# EAGLE design 4G LTE Hat For Raspberry Pi V1.0 (EAGLE 6.1)
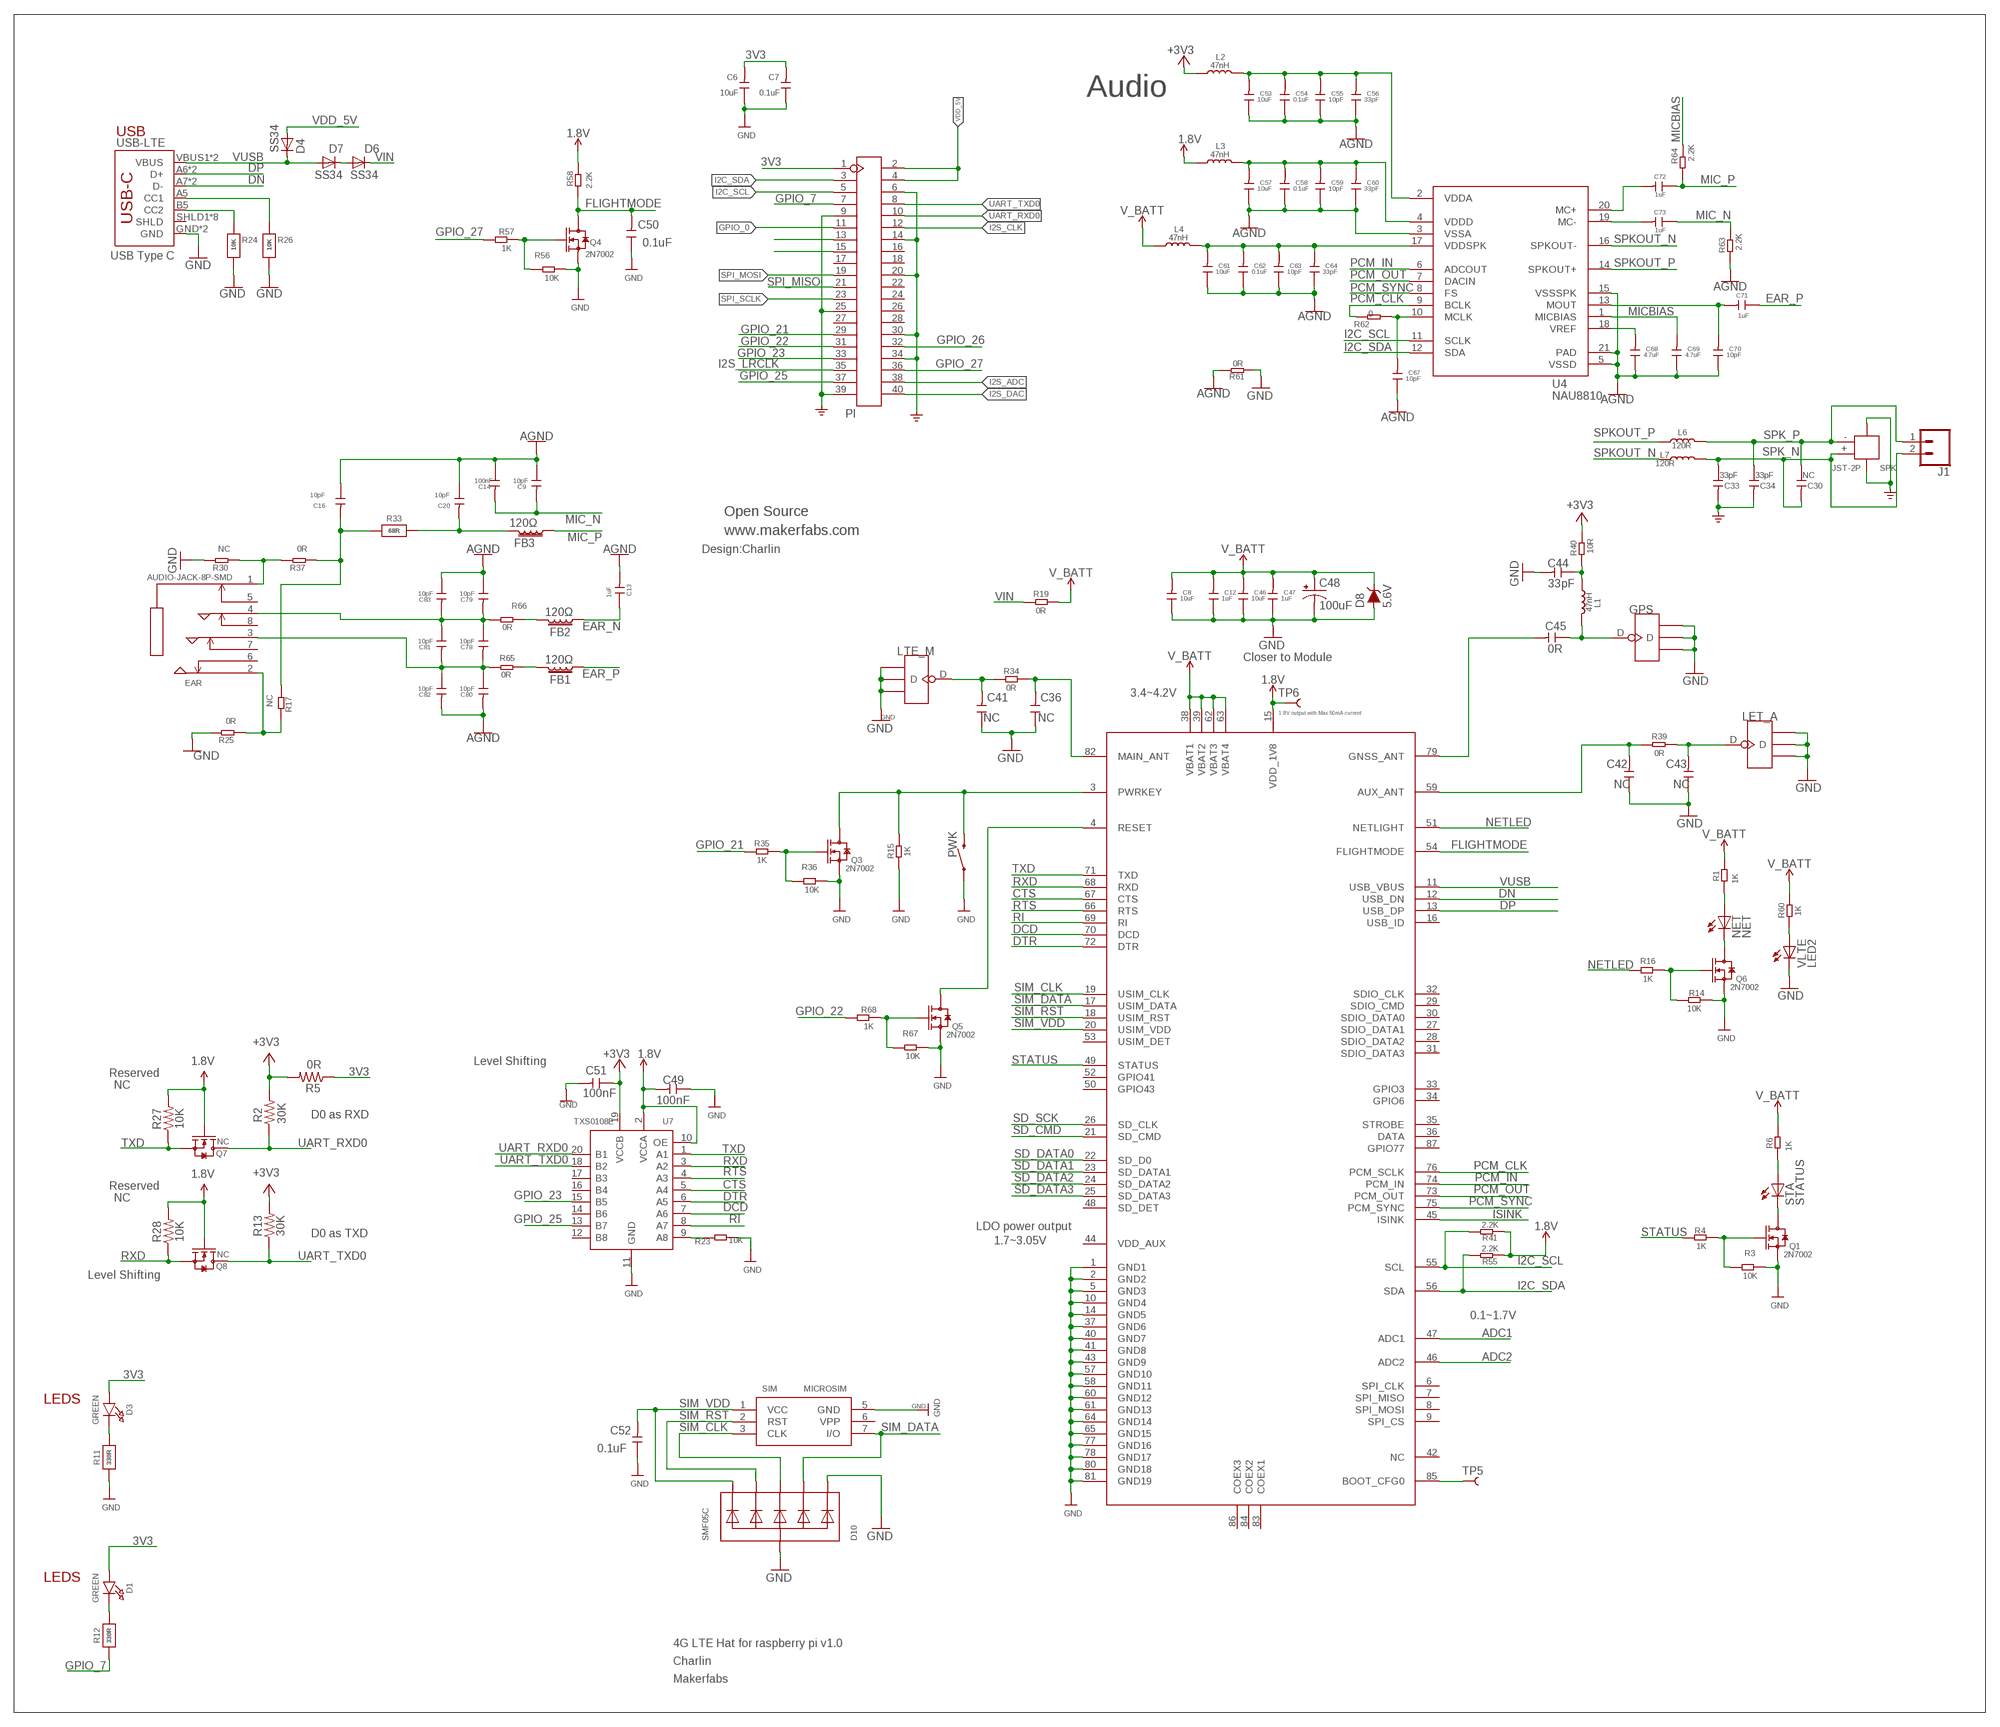
[diagram p0: schematic, sheet 1]

## Parts
C6  10uF  DISCRETE_C-0603  [DISCRETE_C0603]
C7  0.1uF  DISCRETE_C-0603  [DISCRETE_C0603]
C8  10uF  C-0603  [C0603]
C9  10pF  C-0603  [C0603]
C12  1uF  C-0603  [C0603]
C13  1uF  C-0603  [C0603]
C14  100nF  C-0603  [C0603]
C16  10pF  C-0603  [C0603]
C20  10pF  C-0603  [C0603]
C30  NC  CAP-0603  [C0603]
C33  33pF  CAP-0603  [C0603]
C34  33pF  CAP-0603  [C0603]
C36  NC  C-0603  [C0603]
C41  NC  C-0603  [C0603]
C42  NC  C-0603  [C0603]
C43  NC  C-0603  [C0603]
C44  33pF  C-0603  [C0603]
C45  0R  C-0603  [C0603]
C46  10uF  C-0603  [C0603]
C47  1uF  C-0603  [C0603]
C48  100uF  68UF-POLAR-EIA3528-10V-10%(TANT)  [EIA3528]
C49  100nF  C-0603  [C0603]
C50  0.1uF  C-0603  [C0603]
C51  100nF  C-0603  [C0603]
C52  0.1uF  C-0603  [C0603]
C53  10uF  C-0603  [C0603]
C54  0.1uF  C-0603  [C0603]
C55  10pF  C-0603  [C0603]
C56  33pF  C-0603  [C0603]
C57  10uF  C-0603  [C0603]
C58  0.1uF  C-0603  [C0603]
C59  10pF  C-0603  [C0603]
C60  33pF  C-0603  [C0603]
C61  10uF  C-0603  [C0603]
C62  0.1uF  C-0603  [C0603]
C63  10pF  C-0603  [C0603]
C64  33pF  C-0603  [C0603]
C67  10pF  C-0603  [C0603]
C68  4.7uF  C-0603  [C0603]
C69  4.7uF  C-0603  [C0603]
C70  10pF  C-0603  [C0603]
C71  1uF  C-0603  [C0603]
C72  1uF  C-0603  [C0603]
C73  1uF  C-0603  [C0603]
C78  10pF  C-0603  [C0603]
C79  10pF  C-0603  [C0603]
C80  10pF  C-0603  [C0603]
C81  10pF  C-0603  [C0603]
C82  10pF  C-0603  [C0603]
C83  10pF  C-0603  [C0603]
D1  GREEN  LED0805_NOOUTLINE  [CHIPLED_0805_NOOUTLINE]
D3  GREEN  LED0805_NOOUTLINE  [CHIPLED_0805_NOOUTLINE]
D4  SS34  DIODE-DO-214AC  [DO-214AC]
D6  SS34  DIODE-DO-214AC  [DO-214AC]
D7  SS34  DIODE-DO-214AC  [DO-214AC]
D8  5.6V  DIODE-ZENER-MMSZ5232BS  [SOD-323]
D10  SMF05C  TVSARRAY_5LANE  [SOT363]
EAR  AUDIO-JACK-8P-SMD  AUDIO-JACK-8P-SMD'PJ-393'  [AUDIO8P-SMD-3.5-14.5X6.1X4.0MM]
FB1  120Ω  FERRITE_BEAD-0603  [0603]
FB2  120Ω  FERRITE_BEAD-0603  [0603]
FB3  120Ω  FERRITE_BEAD-0603  [0603]
GPS  ANTENNA-U-FL  [4P-U-FL]
J1  CONN_02LOCK  [1X02_LOCK]
L1  47nH  L'0603'  [L0603]
L2  47nH  L'0603'  [L0603]
L3  47nH  L'0603'  [L0603]
L4  47nH  L'0603'  [L0603]
L6  120R  INDUCTOR/FERRITE-BEAD'0603'  [L0603]
L7  120R  INDUCTOR/FERRITE-BEAD'0603'  [L0603]
LET_A  ANTENNA-U-FL  [4P-U-FL]
LTE_M  ANTENNA-U-FL  [4P-U-FL]
NET  NET  LEDCHIP-LED0805  [CHIP-LED0805]
PI  HEADER-2X20P1  [DIP-2X20-2.54MM]
PWK  MOMENTARY-SWITCH-SPST-SMD-6.0X3.5MM  [TACTILE_SWITCH_SMD_6.0X3.5MM]
Q1  2N7002  MOSFET-N'SOT23'  [SOT23]
Q3  2N7002  MOSFET-N'SOT23'  [SOT23]
Q4  2N7002  MOSFET-N'SOT23'  [SOT23]
Q5  2N7002  MOSFET-N'SOT23'  [SOT23]
Q6  2N7002  MOSFET-N'SOT23'  [SOT23]
Q7  NC  MOSFET-N'SOT23'  [SOT23]
Q8  NC  MOSFET-N'SOT23'  [SOT23]
R1  1K  R-0603  [R0603]
R2  30K  300KOHM-0603-1/10W-1%  [0603]
R3  10K  R-0603  [R0603]
R4  1K  R-0603  [R0603]
R5  0R  300KOHM-0603-1/10W-1%  [0603]
R6  1K  R-0603  [R0603]
R11  330R  RESISTOR_0603_NOOUT  [0603-NO]
R12  330R  RESISTOR_0603_NOOUT  [0603-NO]
R13  30K  300KOHM-0603-1/10W-1%  [0603]
R14  10K  R-0603  [R0603]
R15  1K  R-0603  [R0603]
R16  1K  R-0603  [R0603]
R17  NC  R-0603  [R0603]
R19  0R  R-0603  [R0603]
R23  10K  R-0603  [R0603]
R24  10K  RESISTOR_0603_NOOUT  [0603-NO]
R25  0R  R-0603  [R0603]
R26  10K  RESISTOR_0603_NOOUT  [0603-NO]
R27  10K  300KOHM-0603-1/10W-1%  [0603]
R28  10K  300KOHM-0603-1/10W-1%  [0603]
R30  NC  R-0603  [R0603]
R33  68R  RESISTOR_0603_NOOUT  [0603-NO]
R34  0R  R-0603  [R0603]
R35  1K  R-0603  [R0603]
R36  10K  R-0603  [R0603]
R37  0R  R-0603  [R0603]
R39  0R  R-0603  [R0603]
R40  10R  R-0603  [R0603]
R41  2.2K  R-0603  [R0603]
R55  2.2K  R-0603  [R0603]
R56  10K  R-0603  [R0603]
R57  1K  R-0603  [R0603]
R58  2.2K  R-0603  [R0603]
R60  1K  R-0603  [R0603]
R61  0R  R-0603  [R0603]
R62  0  R-0603  [R0603]
R63  2.2K  R-0603  [R0603]
R64  2.2K  R-0603  [R0603]
R65  0R  R-0603  [R0603]
R66  0R  R-0603  [R0603]
R67  10K  R-0603  [R0603]
R68  1K  R-0603  [R0603]
SIM  MICROSIM  [MICROSIM]
SPK  JST-2P  JST-2P-SMD'2.0'  [HW2-SMD-2.0-90D]
STA  STATUS  LEDCHIP-LED0805  [CHIP-LED0805]
TP5  TEST-POINT3  [PAD.03X.03]
TP6  TEST-POINT3  [PAD.03X.03]
U4  NAU8810  [QFN21-50P-400L400W]
U6  SIM7600  [SMD87-100P-3000L300W]
U7  TXS0108E  LOGIC-TXS0108EPWR  [TSSOP20-0.65-6.5X4.4MM]
USB-LTE  USB_C5  [USB-C-16P-5]
VLTE  LED2  LEDCHIP-LED0805  [CHIP-LED0805]

## Nets
1.8V: C49.2 L3.1 Q7.1(G) Q8.1(G) R27.2 R28.2 R41.1 R55.1 R58.2 TP6.P$1 U6.15(VDD_1V8) U7.2(VCCA) U7.10(OE)
3V3: C6.2 C7.2 D1.A D3.A L2.1 PI.1 R5.1 ; supply symbol labelled +3V3
+3V3: C51.1 R2.2 R5.2 R13.2 R40.2 U7.19(VCCB)
ADC1: U6.47(ADC1)
ADC2: U6.46(ADC2)
AGND: C9.1 C13.2 C14.1 C16.1 C20.1 C53.1 C54.1 C55.1 C56.1 C57.1 C58.1 C59.1 C60.1 C61.1 C62.1 C63.1 C64.1 C67.1 C68.1 C69.1 C70.1 C79.1 C80.2 C82.2 C83.1 R61.2 R63.1 U4.3(VSSA) U4.5(VSSD) U4.15(VSSSPK) U4.21(PAD)
CTS: U6.67(CTS) U7.5(A4)
DCD: U6.70(DCD) U7.7(A6)
DN: U6.12(USB_DN) USB-LTE.A7(D-) USB-LTE.B7(D-)
DP: U6.13(USB_DP) USB-LTE.A6(D+) USB-LTE.B6(D+)
DTR: U6.72(DTR) U7.6(A5)
EAR_N: C13.1 FB2.1
EAR_P: C71.1 FB1.1
FLIGHTMODE: C50.2 Q4.3(D) R58.1 U6.54(FLIGHTMODE)
GND: C6.1 C7.1 C8.1 C12.1 C33.2 C34.2 C36.1 C41.1 C42.1 C43.1 C44.2 C46.1 C47.1 C48.C(-) C49.1 C50.1 C51.2 C52.1 D8.A D10.1(C1) D10.2(A) GPS.GND1 GPS.GND2 GPS.GND3 LET_A.GND1 LET_A.GND2 LET_A.GND3 LTE_M.GND1 LTE_M.GND2 LTE_M.GND3 PI.6 PI.9 PI.14 PI.20 PI.25 PI.30 PI.34 PI.39 PWK.1 Q1.2(S) Q3.2(S) Q4.2(S) Q5.2(S) Q6.2(S) R3.1 R11.1 R14.1 R15.1 R23.1 R24.2 R25.2 R26.2 R30.2 R36.1 R56.1 R61.1 R67.1 SIM.5(GND) SPK.3 SPK.4 U6.1(GND1) U6.2(GND2) U6.5(GND3) U6.10(GND4) U6.14(GND5) U6.37(GND6) U6.40(GND7) U6.41(GND8) U6.43(GND9) U6.57(GND10) U6.58(GND11) U6.60(GND12) U6.61(GND13) U6.64(GND14) U6.65(GND15) U6.77(GND16) U6.78(GND17) U6.80(GND18) U6.81(GND19) U7.11(GND) USB-LTE.GND USB-LTE.GND2(GND) VLTE.C ; supply symbol labelled GND_POWER
GPIO_0: PI.11
GPIO_2: PI.13
GPIO_3: PI.15
GPIO_7: PI.7 R12.1
GPIO_21: PI.29 R35.2
GPIO_22: PI.31 R68.2
GPIO_23: PI.33 U7.15(B5)
GPIO_25: PI.37 U7.13(B7)
GPIO_26: PI.32
GPIO_27: PI.36 R57.2
I2C_SCL: PI.5 R41.2 U4.11(SCLK) U6.55(SCL)
I2C_SDA: PI.3 R55.2 U4.12(SDA) U6.56(SDA)
I2S_ADC: PI.38
I2S_CLK: PI.12
I2S_DAC: PI.40
I2S_LRCLK: PI.35
ISINK: U6.45(ISINK)
MIC_N: C9.2 C14.2 C73.1 R63.2
MIC_P: C72.1 FB3.1 R64.1
MICBIAS: C69.2 R64.2 U4.1(MICBIAS)
N$2: Q1.1(G) R3.2 R4.1
N$3: D1.C R12.2
N$4: R6.1 STA.A
N$5: D3.C R11.2
N$6: Q1.3(D) STA.C
N$7: Q6.1(G) R14.2 R16.1
N$8: NET.A R1.1
N$9: NET.C Q6.3(D)
N$10: TP5.P$1 U6.85(BOOT_CFG0)
N$11: D6.A D7.C
N$14: C16.2 R17.1 R33.1 R37.1
N$15: C20.2 FB3.2 R33.2
N$16: EAR.2 R17.2 R25.1
N$17: R26.1 USB-LTE.A5(CC1)
N$19: R24.1 USB-LTE.B5(CC2)
N$20: EAR.1 R30.1 R37.2
N$21: C78.1 C79.2 C81.1 C83.2 EAR.4 R66.1
N$24: R23.2 U7.9(A8)
N$40: C36.2 R34.1 U6.82(MAIN_ANT)
N$41: C41.2 LTE_M.D R34.2
N$42: PWK.2 Q3.3(D) R15.2 U6.3(PWRKEY)
N$43: Q3.1(G) R35.1 R36.2
N$46: R60.1 VLTE.A
N$48: C53.2 C54.2 C55.2 C56.2 L2.2 U4.2(VDDA)
N$49: C70.2 C71.2 U4.13(MOUT)
N$50: C61.2 C62.2 C63.2 C64.2 L4.2 U4.17(VDDSPK)
N$51: C68.2 U4.18(VREF)
N$52: C57.2 C58.2 C59.2 C60.2 L3.2 U4.4(VDDD)
N$54: C73.2 U4.19(MC-)
N$57: C67.2 R62.1 U4.10(MCLK)
N$58: C72.2 U4.20(MC+)
N$59: FB1.2 R65.2
N$63: FB2.2 R66.2
N$64: C78.2 C80.1 C81.2 C82.1 EAR.3 R65.1
N$69: Q5.3(D) U6.4(RESET)
N$70: Q5.1(G) R67.2 R68.1
N$72: C43.2 LET_A.D R39.2
N$73: C44.1 L1.1 R40.1
N$74: C42.2 R39.1 U6.59(AUX_ANT)
N$75: C45.2 U6.79(GNSS_ANT)
N$76: C45.1 GPS.D L1.2
N$94: Q4.1(G) R56.2 R57.1
NETLED: R16.2 U6.51(NETLIGHT)
PCM_CLK: R62.2 U4.9(BCLK) U6.76(PCM_SCLK)
PCM_IN: U4.6(ADCOUT) U6.74(PCM_IN)
PCM_OUT: U4.7(DACIN) U6.73(PCM_OUT)
PCM_SYNC: U4.8(FS) U6.75(PCM_SYNC)
RI: U6.69(RI) U7.8(A7)
RTS: U6.66(RTS) U7.4(A3)
RXD: Q8.2(S) R28.1 U6.68(RXD) U7.3(A2)
SD_CMD: U6.21(SD_CMD)
SD_DATA0: U6.22(SD_D0)
SD_DATA1: U6.23(SD_DATA1)
SD_DATA2: U6.24(SD_DATA2)
SD_DATA3: U6.25(SD_DATA3)
SD_SCK: U6.26(SD_CLK)
SIM_CLK: D10.4(C3) SIM.3(CLK) U6.19(USIM_CLK)
SIM_DATA: D10.3(C2) SIM.7(I/O) U6.17(USIM_DATA)
SIM_RST: D10.5(C4) SIM.2(RST) U6.18(USIM_RST)
SIM_VDD: C52.2 D10.6(C5) SIM.1(VCC) U6.20(USIM_VDD)
SPI_MISO: PI.21
SPI_MOSI: PI.19
SPI_SCLK: PI.23
SPK_N: C30.2 C33.1 J1.2 L7.2 SPK.+
SPK_P: C30.1 C34.1 J1.1 L6.2 SPK.-
SPKOUT_N: L7.1 U4.16(SPKOUT-)
SPKOUT_P: L6.1 U4.14(SPKOUT+)
STATUS: R4.2 U6.49(STATUS)
TXD: Q7.2(S) R27.1 U6.71(TXD) U7.1(A1)
UART_RXD0: PI.10 Q7.3(D) R2.1 U7.20(B1)
UART_TXD0: PI.8 Q8.3(D) R13.1 U7.18(B2)
V_BATT: C8.2 C12.2 C46.2 C47.2 C48.A(+) D8.C L4.1 R1.2 R6.2 R19.1 R60.2 U6.38(VBAT1) U6.39(VBAT2) U6.62(VBAT3) U6.63(VBAT4)
VDD_5V: D4.A PI.2 PI.4
VIN: D6.C R19.2
VUSB: D4.C D7.A U6.11(USB_VBUS) USB-LTE.VBUS1(VBUS) USB-LTE.VBUS2(VBUS)
Unconnected: EAR.5 EAR.6 EAR.7 EAR.8 PI.16 PI.17 PI.18 PI.22 PI.24 PI.26 PI.27 PI.28 SIM.6(VPP) U6.6(SPI_CLK) U6.7(SPI_MISO) U6.8(SPI_MOSI) U6.9(SPI_CS) U6.16(USB_ID) U6.27(SDIO_DATA1) U6.28(SDIO_DATA2) U6.29(SDIO_CMD) U6.30(SDIO_DATA0) U6.31(SDIO_DATA3) U6.32(SDIO_CLK) U6.33(GPIO3) U6.34(GPIO6) U6.35(STROBE) U6.36(DATA) U6.42(NC) U6.44(VDD_AUX) U6.48(SD_DET) U6.50(GPIO43) U6.52(GPIO41) U6.53(USIM_DET) U6.83(COEX1) U6.84(COEX2) U6.86(COEX3) U6.87(GPIO77) U7.12(B8) U7.14(B6) U7.16(B4) U7.17(B3) USB-LTE.SHLD1(SHLD) USB-LTE.SHLD2(SHLD) USB-LTE.SHLD3(SHLD) USB-LTE.SHLD4(SHLD) USB-LTE.SHLD5(SHLD) USB-LTE.SHLD6(SHLD) USB-LTE.SHLD7(SHLD) USB-LTE.SHLD8(SHLD)

## Notes on the sheet
- Audio
- USB
- USB Type C
- Open Source
- www.makerfabs.com
- Design:Charlin
- Closer to Module
- 3.4~4.2V
- 1.8V output with Max 50mA current
- Level Shifting
- Reserved
- NC
- D0 as RXD
- Reserved
- NC
- LDO power output
- D0 as TXD
- 1.7~3.05V
- Level Shifting
- 0.1~1.7V
- LEDS
- LEDS
- 4G LTE Hat for raspberry pi v1.0
- Charlin
- Makerfabs

## Library data of the parts
C6 C7 = A9G:DISCRETE_C*: Ceramic Capacitors
C8 C9 C12-C14 C16 C20 C36 C41-C47 C49-C64 C67-C73 C78-C83 = Discrete:C*: Ceramic Capacitors
C30 C33 C34 = Discrete-new:CAP: Ceramic Capacitors
C48 = SparkFun-Capacitors:68UF-POLAR: 68µF polarized capacitors A capacitor is a passive two-terminal electrical component used to store electrical energy temporarily in an electric field.; PROD_ID: CAP-10790; VALUE: 68uF
D1 D3 = microbuilder:LED: LED
D4 D6 D7 = diode:DIODE-: DIODE
D8 = SparkFun-DiscreteSemi:DIODE-ZENER: Zener Diode A Zener diode allows current to flow from its anode to its cathode like a normal semiconductor diode, but it also permits current to flow in the reverse direction when its "Zener voltage" is reached. - WIkipedia; PROD_ID: DIO-12442
D10 = microbuilder:TVSARRAY_5LANE: Voltage Transient Suppressor Array SOT363 SMF05C - 100W 5V: Digikey - SMF05CT1GOSCT-ND
EAR = Connector-new:AUDIO-JACK-8P-SMD: 320040009
FB1-FB3 = SparkFun-Coils:FERRITE_BEAD: Ferrite Bead (blocks, cores, rings, chokes, etc.) Inductor with layers of ferrite used to suppress high frequencies. Often used to isolate high frequency noise. SparkFun Products: IOIO-OTG - V2.2 <https://www.sparkfun.com/products/13613> SparkFun SAMD21 Mini Breakout <https://www.sparkfun.com/products/13664> SparkFun 6 Degrees of Freedom Breakout - LSM6DS3 <https://www.sparkfun.com/products/13339> SparkFun SAMD21 Dev Breakout <https://www.sparkfun.com/products/13672>; PROD_ID: NDUC-13805; VALUE: 30Ω/1.8A
GPS LET_A LTE_M = Connector:ANTENNA-U-FL
J1 = SparkFun-Connectors:CONN_02: Multi connection point. Often used as Generic Header-pin footprint for 0.1 inch spaced/style header connections On any of the 0.1 inch spaced packages, you can populate with these: Break Away Headers - Straight <https://www.sparkfun.com/products/116> (PRT-00116) Break Away Male Headers - Right Angle <https://www.sparkfun.com/products/553> (PRT-00553) Female Headers <https://www.sparkfun.com/products/115> (PRT-00115) Break Away Headers - Machine Pin <https://www.sparkfun.com/products/117> (PRT-00117) Break Away Female Headers - Swiss Machine Pin <https://www.sparkfun.com/products/743> (PRT-00743) For SCREWTERMINALS and SPRING TERMINALS visit here: Screw Terimnals on SparkFun.com <https://www.sparkfun.com/search/results?term=Screw+Terminals> (5mm/3.5mm/2.54mm spacing) This device is also useful as a general connection point to wire up your design to another part of your project. Our various solder wires solder well into these plated through hole pads. Hook-Up Wire - Assortment (Stranded, 22 AWG) <https://www.sparkfun.com/products/11375> (PRT-11375) Hook-Up Wire - Assortment (Solid Core, 22 AWG) <https://www.sparkfun.com/products/11367> (PRT-11367) View the entire wire category on our website here <https://www.sparkfun.com/categories/141> Special notes: Molex polarized connector foot print use with: PRT-08233 with associated crimp pins and housings. 2.54_SCREWTERM for use with PRT-10571. 3.5mm Screw Terminal footprints for PRT-08084 5mm Screw Terminal footprints for use with PRT-08432
L1-L4 = Discrete:L*
L6 L7 = Discrete-new:INDUCTOR/FERRITE-BEAD
NET STA VLTE = adafruit2:LED: LED
PI = self:HEADER-2X20P
PWK = SparkFun-Switches:MOMENTARY-SWITCH-SPST: Momentary Switch (Pushbutton) - SPST Normally-open (NO) SPST momentary switches (buttons, pushbuttons). Variants PTH-12MM - 12mm square, through-hole Momentary Pushbutton Switch - 12mm Square <https://www.sparkfun.com/products/9190> (COM-09190) PTH-6.0MM, PTH-6.0MM-KIT - 6.0mm square, through-hole Mini Pushbutton Switch <https://www.sparkfun.com/products/97> (COM-00097) KIT package intended for soldering kit's - only one side of pads' copper is exposed. PTH-RIGHT-ANGLE-KIT - Right-angle, through-hole Right Angle Tactile Button <https://www.sparkfun.com/products/10791> - Used on SparkFun BigTime Watch Kit <https://www.sparkfun.com/products/11734> SMD-12MM - 12mm square, surface-mount Tactile Button - SMD (12mm) <https://www.sparkfun.com/products/12993> (COM-12993) Used on SparkFun PicoBoard <https://www.sparkfun.com/products/11888> SMD-4.5MM - 4.5mm Square Trackball Switch Used on SparkFun Blackberry Trackballer Breakout <https://www.sparkfun.com/products/13169> SMD-4.6MMX2.8MM - 4.60mm x 2.80mm, surface mount Used on SparkFun SAMD21 Mini Breakout <https://www.sparkfun.com/products/13664> SMD-5.2MM, SMD-5.2-REDUNDANT - 5.2mm square, surface-mount Mini Pushbutton Switch - SMD <https://www.sparkfun.com/products/8720> (COM-08720) Used on Arduino Pro Mini <https://www.sparkfun.com/products/11114> REDUNDANT package connects both switch circuits together SMD-6.0X3.5MM - 6.0 x 3.5mm, surface mount Momentary Reset Switch SMD <https://www.sparkfun.com/products/8229> (COM-08229) SMD-6.2MM-TALL - 6.2mm square, surface mount Tactile Button - SMD (6mm) <https://www.sparkfun.com/products/12992> Used on SparkFun Digital Sandbox <https://www.sparkfun.com/products/12651> SMD-RIGHT-ANGLE - Right-angle, surface mount Used on SparkFun Block for Intel® Edison - Arduino <https://www.sparkfun.com/products/13036>; PROD_ID: SWCH-00815; SF_SKU: COM-08229
Q1 Q3-Q8 = Discrete:MOSFET-N: IRLL014: http://www.vishay.com/docs/91319/sihll014.pdf
R1 R3 R4 R6 R14-R17 R19 R23 R25 R30 R34-R37 R39-R41 R55-R58 R60-R68 = Discrete:R*
R2 R5 R13 R27 R28 = SparkFun-Resistors:300KOHM: 300kΩ resistor A resistor is a passive two-terminal electrical component that implements electrical resistance as a circuit element. Resistors act to reduce current flow, and, at the same time, act to lower voltage levels within circuits. - Wikipedia; PROD_ID: RES-10809; VALUE: 300k
R11 R12 R24 R26 R33 = microbuilder:RESISTOR: Resistors For new designs, use the packages preceded by an '_' character since they are more reliable: The following footprints should be used on most boards: _0402 - Standard footprint for regular board layouts _0603 - Standard footprint for regular board layouts _0805 - Standard footprint for regular board layouts _1206 - Standard footprint for regular board layouts For extremely tight-pitch boards where space is at a premium, the following 'micro-pitch' footprints can be used (smaller pads, no silkscreen outline, etc.): _0402MP - Micro-pitch footprint for very dense/compact boards _0603MP - Micro-pitch footprint for very dense/compact boards _0805MP - Micro-pitch footprint for very dense/compact boards _1206MP - Micro-pitch footprint for very dense/compact boards
SIM = Connector:MICROSIM
SPK = Connector-new:JST-2P-SMD: 2P-SMD-1.0-90D:320110054;2P-SMD-2.0-90D:320110026
TP5 TP6 = SparkFun-Connectors:TEST-POINT: SparkFun Test Points Bare copper test points for troubleshooting or In-Circuit-Testing. These are used by our Production team for verifying production board runs using pogo-pins on test beds. SparkFun Products: SparkFun LSM9DS1 Breakout <https://www.sparkfun.com/products/13284> SparkFun PSOC <https://www.sparkfun.com/products/13714> SparkFun Load Cell Amplifier <https://www.sparkfun.com/products/13879>
U4 = user01:NAU8810: NAU8810
U6 = user01:SIM7600
U7 = IC-new:LOGIC-TXS0108EPWR: 310050026
USB-LTE = USBC:USB_C: USB Type C 16Pin Connector Super Speed pins not available on the 16-pin purely SMD connector so this part is best for USB 2.0 implementations. D1 and D2 are tied together enabling D+/- no matter which way the cable is plugged into the connector. The two channel configuration pins (CC1/2) are exposed. These are normally connected to ground via 5.1k resistors but can be reconfigured for high current/high power applications.

## Net classes
2 3V3: width 0.305 mm
3 usbvcc: width 0.508 mm, drill 0.61 mm, clearance 0.254 mm

## Board
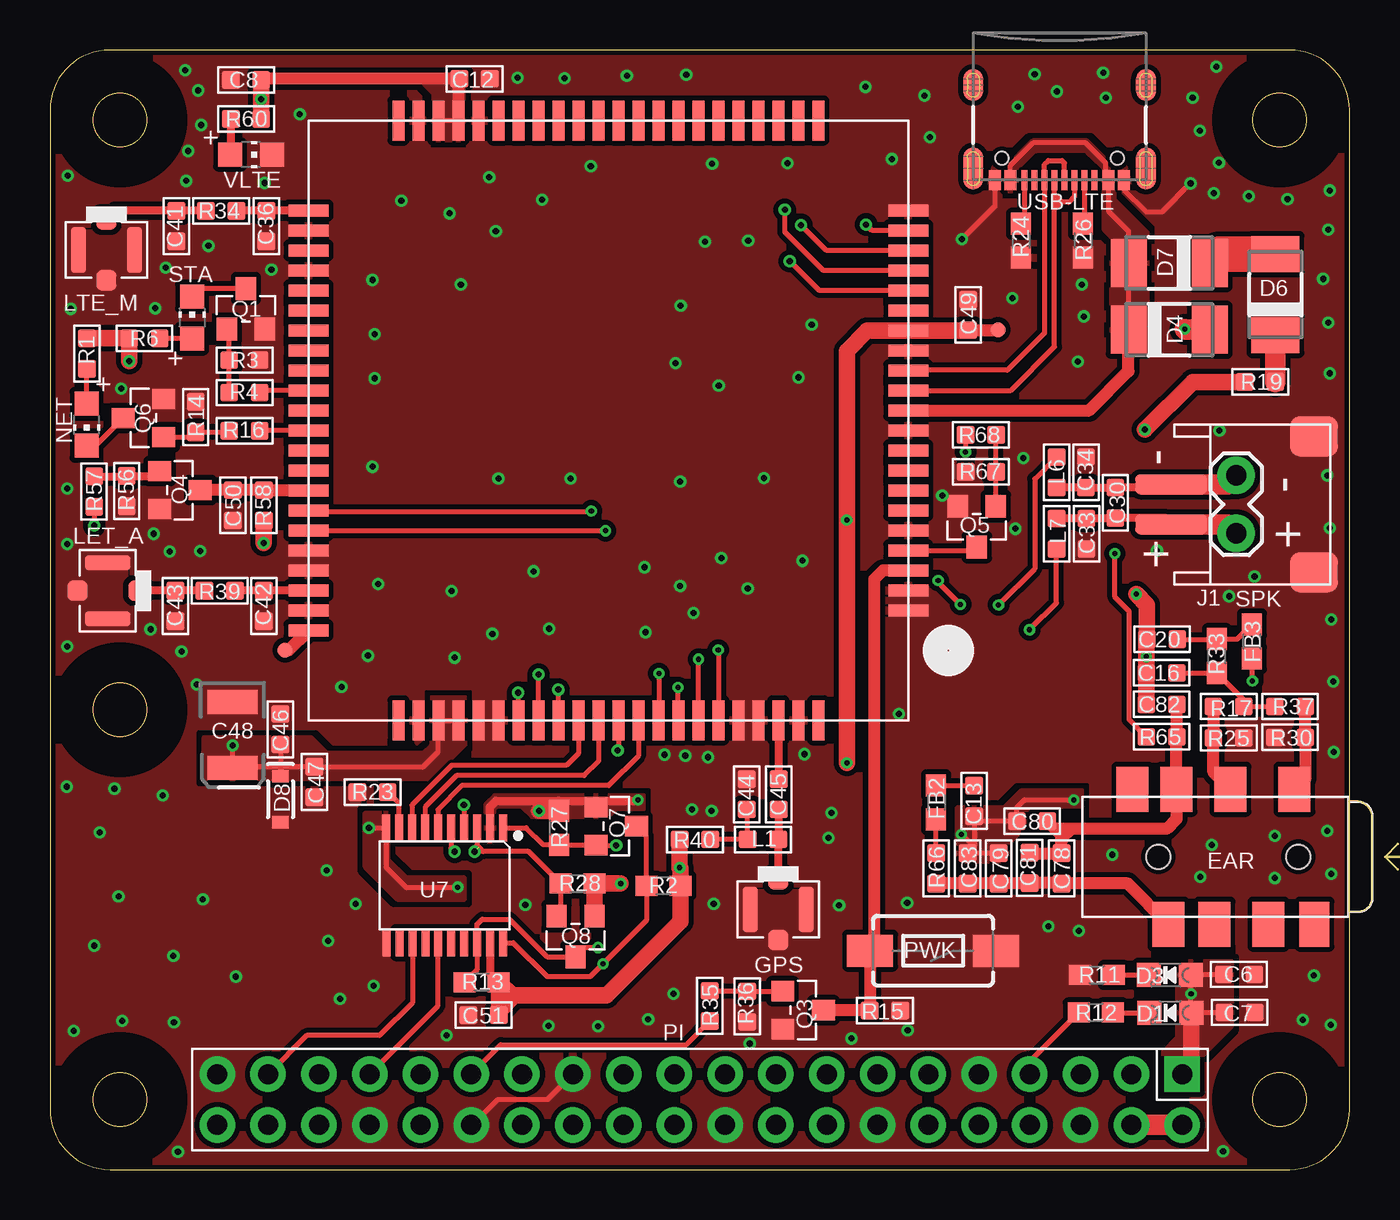
[diagram p1: board, top side]
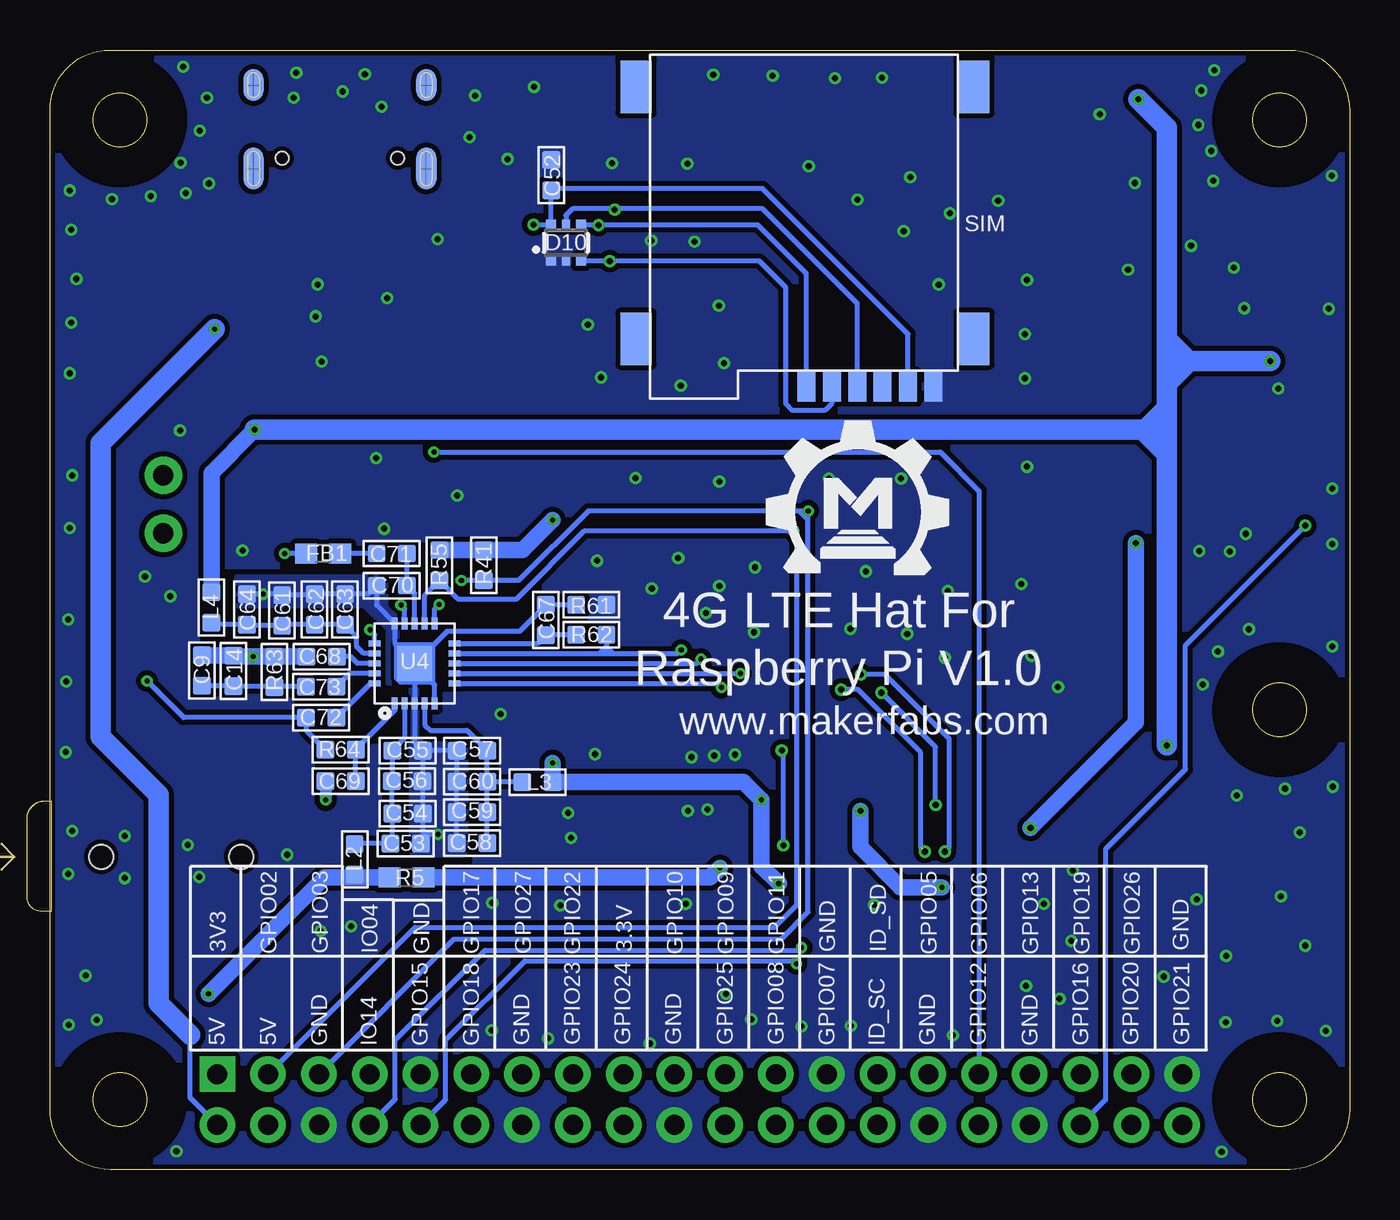
[diagram p2: board, bottom side, seen from below]

Size 65 x 56 mm. Coordinates in mm from the lower left corner, seen from the top.
Outline: 0,53 0,3 arc90 3,0 62,0 arc90 65,3 65,53 arc90 62,56 3,56 arc90 0,53
Outline: circle at 61.5,3.5 radius 1.35
Outline: circle at 61.5,52.5 radius 1.35
Outline: circle at 3.5,3.5 radius 1.35
Outline: circle at 3.5,52.5 radius 1.35
Outline: circle at 3.5,23 radius 1.35
Copper layers (1*16): Top 0.035mm / dielectric 1.5mm / Bottom 0.035mm
Design rules: minimum track width 6mil, minimum drill 10mil, track to track 6mil, track to pad 6mil, pad to pad 6mil, via to via 6mil, smd to smd 0mil, copper to edge 10mil, drill to drill 10mil, minimum pad ring 10mil, minimum via ring 6mil, stop-mask expansion 2mil, vias tented up to drill 100mil, thermal gap 0mil
tRestrict: area 0.5,0.5 to 6.5,6.5; area 58.5,0.5 to 64.5,6.5; area 58.5,49.5 to 64.5,55.5; area 0.5,49.5 to 6.5,55.5; area 0.5,20 to 6.5,26
bRestrict: area 58.5,49.5 to 64.5,55.5; area 0.5,49.5 to 6.5,55.5; area 58.5,0.5 to 64.5,6.5; area 0.5,0.5 to 6.5,6.5; area 0.5,20 to 6.5,26; area 0.5,20 to 6.5,26

### Footprints (pad centres in the part's own frame; a part is rotated, then mirrored left to right if it is on the bottom)
DISCRETE_C0603 = smd 0.889 x 0.889: 1 -0.762,0; 2 0.762,0
C0603 = smd 0.889 x 0.889: 1 -0.762,0; 2 0.762,0
C0603' = smd 0.889 x 0.889: 1 0,0.762; 2 0,-0.762
EIA3528 = smd 1.2 x 2.5: A 1.65,0; C -1.65,0
CHIPLED_0805_NOOUTLINE = smd 1.2 x 1.2: A 0,-1.05; C 0,1.05
DO-214AC = smd 1.8 x 2.4: A 2.025,0; C -2.025,0
SOD-323 = smd 0.63 x 0.83: A 1.15,0; C -1.15,0
SOT363 = smd 0.5 x 0.5: 1 -0.75,-0.9; 3 0.75,-0.9; 4 0.75,0.9; 6 -0.75,0.9 | smd 0.4 x 0.5: 2 0,-0.9; 5 0,0.9
AUDIO8P-SMD-3.5-14.5X6.1X4.0MM = smd 1.6 x 2.25: 1 3.9,-3.375; 2 7.1,-3.375; 3 9.8,-3.375; 4 10.2,3.375; 6 5.2,3.375; 7 7.9,3.375; 8 12,-3.375 | smd 1.5 x 2.25: 5 2.9,3.375 | hole 1.2: 3.7,0; 10.7,0
0603 = smd 1.1 x 1: 1 -0.85,0; 2 0.85,0
4P-U-FL = smd 1.016 x 1.016: D -1.524,0; GND3 1.524,0 | smd 2.286 x 0.762: GND1 0,1.397; GND2 0,-1.397
1X02_LOCK = drill 1.016 pad 1.88: 1 -0.178,0; 2 2.718,0
L0603 = smd 0.889 x 0.889: 1 -0.762,0; 2 0.762,0
CHIP-LED0805 = smd 1.2 x 1.2: A 0,-1.05; C 0,1.05
DIP-2X20-2.54MM = drill 1 pad 1.778 square: 1 24.13,1.27 | drill 1 pad 1.778: 2 24.13,-1.27; 3 21.59,1.27; 4 21.59,-1.27; 5 19.05,1.27; 6 19.05,-1.27; 7 16.51,1.27; 8 16.51,-1.27; 9 13.97,1.27; 10 13.97,-1.27; 11 11.43,1.27; 12 11.43,-1.27; 13 8.89,1.27; 14 8.89,-1.27; 15 6.35,1.27; 16 6.35,-1.27; 17 3.81,1.27; 18 3.81,-1.27; 19 1.27,1.27; 20 1.27,-1.27; 21 -1.27,1.27; 22 -1.27,-1.27; 23 -3.81,1.27; 24 -3.81,-1.27; 25 -6.35,1.27; 26 -6.35,-1.27; 27 -8.89,1.27; 28 -8.89,-1.27; 29 -11.43,1.27; 30 -11.43,-1.27; 31 -13.97,1.27; 32 -13.97,-1.27; 33 -16.51,1.27; 34 -16.51,-1.27; 35 -19.05,1.27; 36 -19.05,-1.27; 37 -21.59,1.27; 38 -21.59,-1.27; 39 -24.13,1.27; 40 -24.13,-1.27
TACTILE_SWITCH_SMD_6.0X3.5MM = smd 2.3 x 1.6: 1 -3.15,0; 2 3.15,0
SOT23 = smd 1.016 x 1.143: 1 -0.95,-1.016; 2 0.95,-1.016; 3 0,1.016
R0603 = smd 0.889 x 0.889: 1 -0.762,0; 2 0.762,0
0603-NO = smd 1.1 x 1: 1 -0.85,0; 2 0.85,0
MICROSIM = smd 1.5 x 0.9: 1 -0.8,2.5; 2 -0.8,5.04; 3 -0.8,7.58; 5 -0.8,1.23; 6 -0.8,3.77; 7 -0.8,6.31 | smd 2.61 x 1.56: P$1 1.6,-0.8; P$2 14.2,-0.8; P$3 14.2,16.1; P$4 1.6,16.1
HW2-SMD-2.0-90D = smd 2 x 2.4: 3 3.4,-2.181; 4 -3.4,-2.181 | smd 1 x 3.6: + -1,4.953; - 1,4.953
PAD.03X.03 = smd 0.762 x 0.762: P$1 0,0
QFN21-50P-400L400W = smd 0.6 x 0.3: 1 0,0; 2 0,-0.5; 3 0,-1; 4 0,-1.5; 5 0,-2; 11 4,-2; 12 4,-1.5; 13 4,-1; 14 4,-0.5; 15 4,0 | smd 0.3 x 0.6: 6 1,-3; 7 1.5,-3; 8 2,-3; 9 2.5,-3; 10 3,-3; 16 3,1; 17 2.5,1; 18 2,1; 19 1.5,1; 20 1,1 | smd 1.75 x 1.75: 21 2,-1
SMD87-100P-3000L300W = smd 2 x 0.6: 1 0,0; 2 0,-1; 3 0,-2; 4 0,-3; 5 0,-4; 6 0,-5; 7 0,-6; 8 0,-7; 9 0,-8; 10 0,-9; 11 0,-10; 12 0,-11; 13 0,-12; 14 0,-13; 15 0,-14; 16 0,-15; 17 0,-16; 18 0,-17; 19 0,-18; 20 0,-19; 41 30,-19; 42 30,-18; 43 30,-17; 44 30,-16; 45 30,-15; 46 30,-14; 47 30,-13; 48 30,-12; 49 30,-11; 50 30,-10; 51 30,-9; 52 30,-8; 53 30,-7; 54 30,-6; 55 30,-5; 56 30,-4; 57 30,-3; 58 30,-2; 59 30,-1; 60 30,0; 81 0,-20; 82 30,-20; 85 30,1 | smd 0.6 x 2: 21 5.5,-24.5; 22 6.5,-24.5; 23 7.5,-24.5; 24 8.5,-24.5; 25 9.5,-24.5; 26 10.5,-24.5; 27 11.5,-24.5; 28 12.5,-24.5; 29 13.5,-24.5; 30 14.5,-24.5; 31 15.5,-24.5; 32 16.5,-24.5; 33 17.5,-24.5; 34 18.5,-24.5; 35 19.5,-24.5; 36 20.5,-24.5; 37 21.5,-24.5; 38 22.5,-24.5; 39 23.5,-24.5; 40 24.5,-24.5; 61 24.5,5.5; 62 23.5,5.5; 63 22.5,5.5; 64 21.5,5.5; 65 20.5,5.5; 66 19.5,5.5; 67 18.5,5.5; 68 17.5,5.5; 69 16.5,5.5; 70 15.5,5.5; 71 14.5,5.5; 72 13.5,5.5; 73 12.5,5.5; 74 11.5,5.5; 75 10.5,5.5; 76 9.5,5.5; 77 8.5,5.5; 78 7.5,5.5; 79 6.5,5.5; 80 5.5,5.5; 83 25.5,-24.5; 84 4.5,-24.5; 86 4.5,5.5; 87 25.5,5.5
TSSOP20-0.65-6.5X4.4MM = smd 0.4 x 1.35: 1 -2.925,-2.875; 2 -2.275,-2.875; 3 -1.625,-2.875; 4 -0.975,-2.875; 5 -0.325,-2.875; 6 0.325,-2.875; 7 0.975,-2.875; 8 1.625,-2.875; 9 2.275,-2.875; 10 2.925,-2.875; 11 2.91,2.875; 12 2.26,2.875; 13 1.61,2.875; 14 0.96,2.875; 15 0.325,2.875; 16 -0.325,2.875; 17 -0.975,2.875; 18 -1.625,2.875; 19 -2.275,2.875; 20 -2.925,2.875
USB-C-16P-5 = smd 0.3 x 1: A5 -1.25,-0.34; A6 -0.25,-0.34; A7 0.25,-0.34; A8 1.25,-0.34; B5 1.75,-0.34; B6 0.75,-0.34; B7 -0.75,-0.34; B8 -1.75,-0.34 | smd 0.6 x 1: GND -3.225,-0.34; GND2 3.225,-0.34; VBUS1 -2.45,-0.34; VBUS2 2.45,-0.34 | smd 1 x 2.1: SHLD1 -4.32,-0.915; SHLD2 4.32,-0.915 | smd 1 x 2.1 bottom: SHLD3 -4.32,-0.915; SHLD4 4.32,-0.915 | smd 1 x 1.6: SHLD5 -4.32,-5.095; SHLD8 4.32,-5.095 | smd 1 x 1.6 bottom: SHLD6 -4.32,-5.095; SHLD7 4.32,-5.095 | hole 0.65: -2.89,-1.445; 2.89,-1.445

### Placement (x,y rotation side)
C6  59.47,9.76 180 top
C7  59.5,7.86 180 top
C8  9.8,54.51 0 top
C9  57.4,24.97 270 bottom
C12  21.23,54.56 180 top
C13  46.23,18.44 270 top
C14  55.83,24.94 270 bottom
C16  55.6,24.84 0 top
C20  55.63,26.52 0 top
C30  NC  [C0603']  53.29,33.35 0 top
C33  33pF  [C0603']  51.84,31.8 0 top
C34  33pF  [C0603']  51.82,34.87 180 top
C36  10.82,47.19 90 top
C41  6.32,47.19 90 top
C42  10.69,28.19 90 top
C43  6.27,28.19 90 top
C44  34.85,18.77 90 top
C45  36.45,18.77 90 top
C46  11.53,22.02 270 top
C47  13.23,19.38 90 top
C48  9.14,21.74 270 top
C49  45.92,42.75 270 top
C50  9.14,33.22 90 top
C51  21.69,7.72 180 top
C52  39.93,49.73 270 bottom
C53  47.22,16.31 180 bottom
C54  47.12,17.81 180 bottom
C55  47.12,20.95 180 bottom
C56  47.14,19.43 180 bottom
C57  43.89,20.95 0 bottom
C58  43.89,16.33 0 bottom
C59  43.89,17.88 0 bottom
C60  43.89,19.41 0 bottom
C61  53.39,27.97 270 bottom
C62  51.77,28.02 270 bottom
C63  50.24,28.02 270 bottom
C64  55.14,28.02 270 bottom
C67  40.21,27.48 270 bottom
C68  51.41,25.65 0 bottom
C69  50.47,19.43 0 bottom
C70  47.9,29.21 0 bottom
C71  47.9,30.81 0 bottom
C72  51.44,22.61 0 bottom
C73  51.44,24.16 0 bottom
C78  50.6,15.06 90 top
C79  47.45,15.06 270 top
C80  49.12,17.42 180 top
C81  49,15.09 90 top
C82  55.6,23.27 180 top
C83  45.9,15.06 270 top
D1  56.03,7.84 90 top
D3  56.02,9.73 90 top
D4  55.98,42.01 0 top
D6  61.29,43.76 90 top
D7  55.98,45.34 180 top
D8  11.53,18.52 270 top
D10  39.19,46.35 0 bottom
EAR  66.14,15.65 180 top
FB1  51.33,30.81 180 bottom
FB2  44.32,18.36 270 top
FB3  60.12,26.42 90 top
GPS  36.42,13 270 top
J1  59.33,34.54 270 top
L1  35.66,16.51 0 top
L2  49.76,15.52 90 bottom
L3  40.61,19.38 180 bottom
L4  56.92,28.12 270 bottom
L6  50.34,34.87 270 top
L7  50.34,31.8 90 top
LET_A  2.9,28.96 180 top
LTE_M  2.82,46 270 top
NET  1.83,37.26 180 top
PI  32.5,3.5 0 top
PWK  44.17,10.95 180 top
Q1  9.8,43.05 0 top
Q3  37.67,7.98 270 top
Q4  6.5,33.99 270 top
Q5  46.35,32.16 180 top
Q6  4.67,37.59 90 top
Q7  28.32,17.17 270 top
Q8  26.29,11.66 180 top
R1  1.85,40.82 90 top
R2  30.68,14.2 0 top
R3  9.73,40.49 180 top
R4  9.73,38.86 0 top
R5  47.17,14.61 0 bottom
R6  4.72,41.58 180 top
R11  52.37,9.74 0 top
R12  52.3,7.86 0 top
R13  21.59,9.37 0 top
R14  7.29,37.64 270 top
R15  41.76,7.95 180 top
R16  9.73,36.96 0 top
R17  58.95,23.16 180 top
R19  60.53,39.4 0 top
R23  16.13,18.87 0 top
R24  48.56,46.46 270 top
R25  58.95,21.59 0 top
R26  51.66,46.46 270 top
R27  25.45,17.09 90 top
R28  26.39,14.3 0 top
R30  62.03,21.62 180 top
R33  58.37,25.68 90 top
R34  8.56,47.96 180 top
R35  32.99,8.18 270 top
R36  34.87,8.15 90 top
R37  62.03,23.16 0 top
R39  8.48,28.96 180 top
R40  32.26,16.51 180 top
R41  43.31,30.23 270 bottom
R55  45.52,30.23 270 bottom
R56  3.84,33.93 90 top
R57  2.21,33.91 270 top
R58  10.69,33.22 270 top
R60  9.8,52.55 0 top
R61  37.92,28.24 180 bottom
R62  37.92,26.75 0 bottom
R63  53.77,24.89 270 bottom
R64  50.47,21.01 0 bottom
R65  55.6,21.64 180 top
R66  44.32,15.06 90 top
R67  46.56,34.9 0 top
R68  46.56,36.75 180 top
SIM  19.58,39.95 90 bottom
SPK  61.04,33.27 90 top
STA  7.11,42.62 0 top
TP5  11.76,25.98 0 top
TP6  47.42,42.01 0 top
U4  47.75,23.32 90 bottom
U6  42.93,27.97 180 top
U7  19.74,14.22 180 top
U$1  [MAKERFABS_0.3]  28.71,29.82 0 bottom
USB-LTE  50.5,49.15 180 top
VLTE  10.06,50.77 270 top

### Tracks (layer width: path | path; a pad name or v marks a point on that pad's centre or on a via)
1.8V  (via drill 0.25, 0.3)
  Top 0.254: v15.95,17.09 U7.10 16.81,15.12 17.8,14.12 v20.4,14.12
  Top 0.406: U7.2 22.01,18.15 22.3,18.44 25.45,18.44 | 25.45,18.44 27.41,18.44 | 27.41,18.44 29.36,18.44 v29.41,18.49 | R27.2 25.45,18.44 | Q7.1 27.3,18.34 27.41,18.44
  Top 0.61: U6.15 45.9,41.97 C49.2 47.4,41.99 TP6.P$1
  Top 0.813: Q8.1 R28.2 v28.55,14.3 | v39.85,20.34 v39.85,32.49 39.85,40.95 40.87,41.96 45.9,41.96 C49.2 | R58.2 v10.69,31.34 | v24.46,17.93 24.47,17.94 R27.2
  Bottom 0.813: R55.1 R41.1 41.35,30.99 v39.85,32.49 | v28.55,14.3 29.41,15.16 v29.41,18.49 30.3,19.38 L3.1 v39.85,20.34 | v10.69,31.34 10.69,22.35 v15.95,17.09 | v20.4,14.12 22.45,14.12 24.46,16.13 v24.46,17.93
  pour Top: 21.82,16.38 21.82,18.29 22.25,18.72 29.67,18.72 29.67,18.03 28.3,18.03 27.89,17.63 24.13,17.63 23.6,18.16 22.35,18.16 22.2,18.01 22.2,16.38
  pour Top: 15.75,17.81 15.75,15.16 17.4,13.51 20.73,13.51 20.73,14.58 17.81,14.58 16.92,15.47 16.92,17.78 16.92,17.81
3V3  (via drill 0.25)
  Top 0.254: C7.2 58.71,7.84 D1.A D3.A | C6.2 58.67,9.73 D3.A | D3.A | v57.07,8.79 D3.A
  Top 0.813: PI.1 57.08,5.22 D1.A
  Bottom 0.813: R5.1 49.84,14.61 | 49.84,14.61 51.26,14.61 v57.07,8.79 | L2.1 49.76,14.68 49.84,14.61
  pour Top: 55.7,5.69 55.7,5.89 56.41,6.6 56.41,10.41 59.08,10.41 59.08,7.16 57.63,5.71 57.63,5.69
+3V3  (via drill 0.25)
  Top 0.406: U7.19 22.01,9.8 R13.2
  Top 0.813: R40.2 v31.5,15.1 31.53,15.06 R2.2 31.53,12.41 27.84,8.71 23.6,8.71 23.24,8.71 | 23.24,8.71 23.1,8.71 R13.2 22.45,9.36 C51.1 | 23.24,8.71 22.43,7.9
  Bottom 0.813: R5.2 31.99,14.61 v31.5,15.1
AGND  (via drill 0.25)
  Top 0.254: C79.1 C83.1 46.23,16.15 | 46.23,16.15 C13.2 46.48,17.42 C80.2 48.36,18.11 48.74,18.49 v51.21,18.49 | 46.23,16.15 46.2,16.15 v45.59,16.76
  Top 0.813: C82.2 C16.1 v54.84,25.65 54.84,26.49 C20.1 54.86,28.25 v54.33,28.78
  Bottom 0.254: U4.21 47.75,26.32 U4.15 48.67,28.23 C70.1 49.1,28.78 C63.1 C62.1 51.82,28.73 C61.1 53.44,28.78 v54.33,28.78 C64.1 | U4.21 46.75,24.74 | 46.75,24.74 U4.3 46.75,21.35 C55.1 | C55.1 C54.1 46.35,16.84 | 46.35,16.84 46.35,16.41 C53.1 | C55.1 C57.1 C60.1 C59.1 C58.1 | C55.1 46.35,19.46 C56.1 | R61.2 C67.1 40.21,28.22 41.5,26.92 45.15,26.92 U4.21 | v45.59,16.76 46.28,16.76 46.35,16.84 | 51.21,19.41 C69.1 | U4.5 45.75,24.24 46.25,24.74 46.75,24.74
  Bottom 0.61: 51.21,19.41 v51.21,18.49
  Bottom 0.813: C68.1 R63.1 v54.84,25.65 55.78,25.65 C14.1 57.38,25.7 C9.1
  pour Bottom: 46.94,15.75 44.25,15.75 44.2,15.8 44.2,21.29 46.33,21.29 46.63,21.59 46.63,24.43 46.84,24.43 46.94,24.43
  pour Bottom: 48.18,29.64 55.65,29.64 55.65,28.22 49.28,28.22 48.31,27.25 48.08,27.03 48.08,24.31 48.06,24.33 45.75,24.33 45.75,26.47 47.45,26.47 47.62,26.64 47.62,27.56 48.13,28.07 48.18,28.12
  pour Top: 45.36,18.08 45.36,15.44 47.85,15.44 47.85,16.23 48.77,17.14 48.77,17.91 49.05,18.19 51.61,18.19 51.61,18.95 48.59,18.95 47.73,18.08
CTS  (via drill 0.3)
  Top 0.254: U6.67 24.43,24.76 v24.43,24.77 | U7.5 20.06,16.08 v20.24,15.9
  Bottom 0.254: v20.24,15.9 20.02,16.13 20.02,21.54 23.24,24.77 v24.43,24.77
DCD
  Top 0.254: U6.70 27.43,20.42 26.72,19.71 20.34,19.71 18.77,18.14 18.77,17.11 U7.7
DN
  Top 0.254: U6.12 48.06,38.97 50.24,41.15 50.24,48.11 | 50.24,48.11 50.24,48.39 | 50.24,48.39 USB-LTE.A7 | USB-LTE.B7 51.24,48.68 50.95,48.39 50.24,48.39 | 50.27,48.74 50.6,48.41 50.27,48.08 50.27,48.09 50.24,48.11
DP
  Top 0.254: U6.13 47.88,39.98 49.74,41.85 USB-LTE.B6 49.74,50.28 49.94,50.47 50.62,50.47 50.75,50.34 50.74,50.34 USB-LTE.A6
DTR
  Top 0.254: U7.6 19.41,18.01 20.6,19.2 27.94,19.2 29.43,20.69 U6.72
EAR_N
  Top 0.254: FB2.1 46.22,19.21 C13.1
EAR_P
  Bottom 0.254: C71.1 FB1.1
FLIGHTMODE
  Top 0.61: U6.54 10.71,33.97 R58.1 C50.2 Q4.3
GND  (via drill 0.3)
  Top 0.254: PI.30 21.13,2.23 22.4,3.5 24.89,3.5 PI.25 | USB-LTE.GND2 47.27,48.19 v45.62,46.53 | USB-LTE.GND 53.72,49.02 54.84,47.9 55.63,47.9 v57.05,49.33
  other vias: 58.67,0.91 62.66,7.49 63.22,9.7 1.19,6.93 6.4,0.89 7.42,53.98 6.76,54.99 7.57,52.25 6.91,50.95 64.01,48.97 59.97,48.69 58.34,55.17 58.47,50.37 57.51,51.97 58.22,48.84 40.79,54.15 28.85,54.71 50.37,53.92 64.06,7.24 57.15,53.62 0.89,49.71 61.9,48.54 3.61,7.44 19.84,6.71 16.18,9.19 13.92,11.43 14.5,8.53 13.84,14.96 7.65,13.51 2.49,16.87 3.43,13.67 0.84,19.15 5.64,18.72 3.23,19.05 9.3,9.65 6.2,7.37 6.17,10.69 2.21,11.2 15.29,13.28 23.77,13.23 24.94,7.19 27.41,7.16 29.92,7.52 31.19,8.79 33.2,13.28 39.47,13.21 38.94,16.59 39.09,17.83 32.11,18.01 33.1,17.93 30.73,20.75 32.92,20.62 31.78,20.7 37.74,20.78 34.9,29.06 31.52,29.18 29.74,30.12 29.79,26.87 32.18,27.84 33.58,30.58 37.64,30.45 20.09,28.93 24.18,29.92 24.97,27.05 22.12,26.8 20.24,25.6 16.41,29.29 15.9,25.7 14.58,24.13 11.07,45.01 16.13,44.5 16.23,41.78 16.23,39.57 17.58,48.46 12.5,52.78 10.74,49.35 6.81,49.45 1.04,43.05 5.26,43.08 5.79,45.11 7.92,46.2 3.56,39.07 7.52,30.94 5.99,30.91 5.18,31.8 0.86,31.29 0.86,34.06 0.86,26.16 6.58,25.91 5.03,27.03 7.34,24.26 16.13,35.15 22.43,34.57 26.04,34.57 31.52,34.42 35.71,34.59 31.55,43.21 37.44,39.62 24.61,48.51 19.99,47.83 22.3,46.94 42.11,50.55 36.88,50.34 33.12,50.32 27.05,50.19 43.74,53.72 44.02,51.64 48.41,53.16 52.81,53.62 52.68,54.86 49.25,54.79 51.71,42.67 51.61,44.27 51.41,40.41 48.13,43.59 44.63,33.71 58.98,28.68 60.25,29.67 64.08,27.51 64.19,24.41 64.21,20.88 64.01,32.08 63.88,34.72 63.68,44.55 63.93,42.37 64.01,39.83 63.93,47.02 31.83,54.76 25.73,54.58 23.39,54.61 31.29,40.34 33.45,39.22 32.77,46.41 34.92,46.46 20.55,44.27 38.1,42.27 58.5,36.96 53.14,15.75 58.12,16.23 57.53,14.63 61.26,16.69 61.26,14.58 63.88,16.94 64.08,14.78 49.94,12.17 42.88,13.34 42.47,22.78 55.37,30.96 48.69,35.59 48.29,32.05 35,6.3 40.08,6.55 42.9,6.96 51.46,11.94 21.97,49.63
  pour Bottom (isolate 0.254, rank 6): -7.62,60 70,60 70,-5.08 -7.62,-5.08
  pour Top (isolate 0.254, rank 6): -7.62,60 70,60 70,-5.08 -7.62,-5.08
GPIO_7
  Top 0.254: PI.7 49.01,5.42 R12.1
GPIO_21
  Top 0.254: PI.29 22.55,6.25 31.83,6.25 R35.2
GPIO_22  (via drill 0.25)
  Top 0.254: R68.2 v45.8,35.89
  Bottom 0.254: PI.31 18.53,33.95 20.47,35.89 v45.8,35.89
GPIO_23
  Top 0.254: PI.33 19.41,8.19 U7.15
GPIO_25
  Top 0.254: U7.13 18.13,8.35 16.48,6.71 12.85,6.71 PI.37
GPIO_27  (via drill 0.3)
  Top 0.254: R57.2 v2.21,32.21
  Bottom 0.254: PI.36 13.45,2.25 12.19,3.5 12.19,16.03 8.2,20.02 8.2,26.21 v2.21,32.21
I2C_SCL  (via drill 0.25)
  Top 0.254: U6.55 12.97,32.92 27.05,32.92 v27.08,32.94 | v44.42,29.46 44.42,29.39 v45.54,28.27
  Bottom 0.254: PI.5 44.79,11.53 28.42,11.53 27.08,12.88 v27.08,32.94 27.51,32.94 | 27.51,32.94 38.08,32.94 41.55,29.46 R41.2 v44.42,29.46 | U4.11 45.75,28.06 v45.54,28.27 | 27.51,32.94 27.1,32.54
I2C_SDA  (via drill 0.25)
  Top 0.254: U6.56 27.77,31.96 v27.79,31.95
  Bottom 0.254: PI.3 46.74,12.12 28.75,12.12 27.64,13.23 27.64,31.5 | U4.12 46.25,28.73 R55.2 44.6,28.55 41.66,28.55 38.25,31.95 28.22,31.95 28.09,31.95 | 27.64,31.5 27.64,31.8 v27.79,31.95 28.09,31.95 | 28.09,31.95 27.64,31.5
MIC_N
  Bottom 0.254: C73.1 53.75,24.16 R63.2 53.82,24.18 C14.2 57.38,24.18 C9.2
MIC_P  (via drill 0.25)
  Top 0.254: FB3.1 60.12,24.46 v60.15,24.43
  Bottom 0.254: v60.15,24.43 58.32,22.61 C72.1 52.2,21.97 R64.1
MICBIAS
  Bottom 0.254: C69.2 R64.2 47.75,22.96 U4.1
N$2
  Top 0.254: R4.1 R3.2 8.97,41.92 Q1.1
N$3
  Top 0.254: R12.2 53.17,7.84 D1.C
N$4
  Top 0.254: STA.A R6.1
N$5
  Top 0.254: R11.2 53.23,9.73 D3.C
N$6
  Top 0.254: Q1.3 7.51,44.07 STA.C
N$7
  Top 0.254: Q6.1 7.05,36.64 R14.2 8.89,36.88 R16.1
N$8
  Top 0.254: NET.A 1.83,40.03 R1.1
N$9
  Top 0.254: NET.C 2.28,36.21 Q6.3
N$10
  Top 0.254: U6.85 12.93,26.87
  Top 0.61: TP5.P$1 11.95,25.98 U6.85
N$11
  Top 1.778: D7.C 58.46,45.79 D6.A
N$14
  Top 0.254: R37.1 R17.1 59.72,23.48 R33.1 58.36,24.84 C16.2
N$15
  Top 0.254: C20.2 58.36,26.52 R33.2 59.38,26.53 FB3.2
N$16
  Top 0.61: R17.2 R25.1 58.19,19.87 EAR.2
N$17
  Top 0.254: USB-LTE.A5 51.74,47.39 R26.1
N$19
  Top 0.254: USB-LTE.B5 48.74,47.49 R24.1
N$20
  Top 0.61: R37.2 R30.1 62.79,19.57 EAR.1
N$21
  Top 0.61: EAR.4 53.91,14.3 C78.1 50.57,14.33 C81.1 48.97,14.3 C79.2 C83.2 R66.1
N$24
  Top 0.254: U7.9 17.46,18.3 R23.2
N$40
  Top 0.406: U6.82 C36.2 R34.1
N$41
  Top 0.406: R34.2 C41.2 3.25,47.95 LTE_M.D
N$42
  Top 0.61: U6.3 41.67,29.96 41.22,29.52 41.22,11.15 PWK.2 41.02,7.97 R15.2 40.97,7.98 Q3.3
N$43
  Top 0.254: R35.1 34.85,8.94 R36.2 36.64,8.91 Q3.1
N$46
  Top 0.406: R60.1 9.04,50.81 VLTE.A
N$48
  Bottom 0.254: U4.2 47.25,21.58 C55.2 47.88,19.46 C56.2 47.9,17.83 C54.2 47.88,16.41 C53.2 49.73,16.31 L2.2
N$49
  Bottom 0.254: U4.13 46.75,28.82 C70.2 C71.2
N$50
  Bottom 0.254: U4.17 49.31,25.82 49.66,26.16 49.66,26.67 C63.2 C62.2 53.34,27.25 C61.2 55.09,27.2 C64.2 56.82,27.25 L4.2
N$51
  Bottom 0.254: U4.18 49.62,25.32 49.96,25.65 C68.2
N$52
  Bottom 0.254: C58.2 C59.2 C60.2 | C60.2 C57.2 44.15,21.97 45.97,21.97 46.25,22.25 U4.4 | L3.2 43.1,19.38 C60.2
N$54
  Bottom 0.254: U4.19 50.01,24.82 C73.2
N$57
  Bottom 0.254: R62.1 40.18,26.75 C67.2 40.61,26.32 U4.10
N$58
  Bottom 0.254: U4.20 48.96,24.32 C72.2
N$59  (via drill 0.25)
  Top 0.254: R65.2 53.98,22.5 53.98,27.91 53.26,28.63 v53.26,30.81
  Bottom 0.254: FB1.2 v53.26,30.81
N$63
  Top 0.254: R66.2 FB2.2
N$64
  Top 0.61: C81.2 49.02,15.82 C78.2 50.6,16.41 50.6,16.59 | 51.05,17.04 55.85,17.04 56.34,17.53 EAR.3 56.34,21.62 R65.1 C82.1 | 51.05,17.04 50.27,17.04 | 50.27,17.04 C80.1 | 50.6,16.59 50.6,16.71 50.27,17.04 | 50.6,16.59 51.05,17.04
N$69
  Top 0.254: U6.4 46.18,30.96 Q5.3
N$70
  Top 0.254: Q5.1 47.3,34.88 R67.2 R68.1
N$72
  Top 0.406: R39.2 C43.2 LET_A.D
N$73
  Top 0.254: C44.1 34.9,17.96 L1.1 R40.1
N$74
  Top 0.406: U6.59 10.7,28.96 C42.2 R39.1
N$75
  Top 0.406: U6.79 36.43,19.56 C45.2
N$76
  Top 0.406: C45.1 36.45,16.54 L1.2 GPS.D
N$94
  Top 0.406: R57.1 3.81,34.67 R56.2 5.25,34.7 Q4.1
NETLED
  Top 0.254: U6.51 R16.2
PCM_CLK  (via drill 0.25)
  Top 0.254: v33.43,25.98 U6.76
  Bottom 0.254: U4.9 37.08,25.82 | 37.08,25.82 33.59,25.82 v33.43,25.98 | 37.16,26.14 37.16,25.89 37.08,25.82 | R62.2 37.16,26.14 | 37.16,26.14 36.85,25.83 37.49,25.83 37.19,26.14
PCM_IN  (via drill 0.25)
  Top 0.254: U6.74 v31.42,24.11
  Bottom 0.254: U4.6 31.63,24.32 v31.42,24.11
PCM_OUT  (via drill 0.25)
  Top 0.254: v30.45,24.82 30.45,22.49 U6.73
  Bottom 0.254: U4.7 v30.46,24.82 v30.45,24.82
PCM_SYNC  (via drill 0.25)
  Top 0.254: U6.75 v32.44,25.53
  Bottom 0.254: U4.8 32.65,25.32 v32.44,25.53
RI
  Top 0.254: U6.69 26.43,20.81 25.83,20.22 20.09,20.22 18.11,18.24 U7.8
RTS  (via drill 0.3)
  Top 0.254: U6.66 v23.43,23.84 v23.42,23.85 | v20.7,18.24 U7.4
  Bottom 0.254: v20.7,18.24 20.7,21.13 v23.42,23.85
RXD  (via drill 0.3)  (1 unrouted)
  Top 0.254: U6.68 v25.43,24 | Q8.2 25.54,12.88 R28.1 23.94,15.9 21.67,15.9 | U7.3 21.36,16.03 | 21.67,15.9 v21.23,15.9 | 21.36,16.23 21.36,16.2 21.67,15.9
  Bottom 0.254: v21.23,15.9 21.44,16.1 21.44,20.85 24.59,24 v25.43,24
SIM_CLK  (via drill 0.3)
  Top 0.254: U6.19 38.84,45.97 v37.57,47.24
  Bottom 0.254: SIM.3 27.16,44.82 29.59,47.24 v37.57,47.24 D10.4
SIM_DATA  (via drill 0.3)
  Top 0.254: U6.17 38.48,43.97 v37,45.44
  Bottom 0.254: SIM.7 25.89,38.32 26.24,37.97 27.86,37.97 28.19,38.3 28.19,44.12 29.52,45.44 v37,45.44 38.43,45.44 D10.3
SIM_RST  (via drill 0.3)
  Top 0.254: U6.18 38.68,44.97 36.75,46.89 v36.75,48.01
  Bottom 0.254: SIM.2 24.62,43.32 29.36,48.06 36.75,48.06 | 36.75,48.06 38.86,48.06 39.19,47.73 D10.5 | v36.75,48.01 36.75,48.06
SIM_VDD  (via drill 0.3)
  Top 0.254: U6.20 41.12,46.97 v40.82,47.27
  Bottom 0.254: SIM.1 22.08,41.79 29.36,49.07 39.83,49.07 C52.2 39.94,48.96 D10.6 39.96,47.27 v40.82,47.27
SPK_N
  Top 0.406: SPK.+ 55.77,32.59 C30.2 53.26,32.56 C33.1 L7.2
  Top 1.016: SPK.+ 58.89,32.27 J1.2
SPK_P
  Top 0.406: SPK.- 55.92,34.11 C30.1 C34.1 L6.2
  Top 1.016: SPK.- 58.89,34.27 J1.1
SPKOUT_N  (via drill 0.25)
  Top 0.254: L7.1 50.34,28.35 v49,27
  Bottom 0.254: U4.16 48.75,26.76 v49,27
SPKOUT_P  (via drill 0.25)
  Top 0.254: L6.1 49.25,34.54 49.25,30.05 v47.45,28.25
  Bottom 0.254: U4.14 47.25,28.05 v47.45,28.25
STATUS
  Top 0.254: U6.49 10.59,38.97 R4.2
TXD  (via drill 0.3)
  Top 0.254: U7.1 23.82,17.1 24.66,16.26 25.44,16.26 R27.1 | 25.44,16.23 R27.1 | R27.1 27.28,16.24 Q7.2 28.31,16.22 v28.32,16.2 | U6.71 28.43,20.98 v28.4,20.95
  Bottom 0.254: v28.32,16.2 28.32,20.88 v28.4,20.95
UART_RXD0  (via drill 0.25)
  Top 0.254: U7.20 23.17,11.35 24.87,9.65 27.03,9.65 v27.66,10.29 29.83,12.46 R2.1 29.83,16.67 Q7.3
  Bottom 0.254: PI.10 45.21,3.49 45.21,6.48 41.25,10.44 27.81,10.44 v27.66,10.29
UART_TXD0  (via drill 0.25)
  Top 0.254: R13.1 21.36,9.99 U7.18 21.36,12.27 21.61,12.52 22.99,12.52 24.87,10.64 Q8.3 26.75,11.1 v27.41,11.1
  Bottom 0.254: PI.8 47.73,3.51 47.73,6.48 43.23,10.97 27.53,10.97 v27.41,11.1
V_BATT  (via drill 0.3)
  Top 0.254: U6.63 U6.62 19.41,22.45 19.41,20.88 18.67,20.14 C47.2 11.48,20.14 | v9.14,21.21 C48.A 9.19,20.14 11.48,20.14 | C46.2 D8.C 11.53,20.09 11.48,20.14 | U6.38 U6.39
  Top 0.61: C8.2 10.62,54.56 C12.2 20.43,54.51 U6.38
  Top 0.813: R1.2 R6.2 v3.96,40.44 | R60.2 v10.57,53.54 C8.2 | R19.1 57.15,39.4 v54.76,37.01
  Bottom 0.813: 9.17,37.01 9.14,37.03 | L4.1 56.92,34.85 v54.76,37.01 | 7.42,40.46 7.77,40.46 | 7.77,40.46 7.85,40.46 | 7.85,40.46 7.92,40.46 9.17,41.71 9.17,39.14 | 9.17,38.68 9.17,39.14 | 9.17,39.14 7.85,40.46 | 9.04,40.44 7.77,40.44 7.77,40.46 | 11.18,37.06 10.31,37.06 9.14,38.23 9.14,35.64 | 9.14,35.41 9.14,35.64 | 9.14,35.64 10.46,36.96
  Bottom 1.016: v9.14,21.21 9.14,35.41 9.14,37.03 9.14,38.23 9.14,40.54 | 9.14,40.54 9.14,52.12 v10.57,53.54 | v3.96,40.44 9.04,40.44 9.14,40.54 | 9.17,37.01 v54.76,37.01
  pour Top: 19.1,23.62 20.75,23.62 20.75,21.29 19,19.53 7.72,19.53 7.72,21.62 12.27,21.62 13.03,21.62 13.82,20.83 18.69,20.83 19.05,21.18 19.1,21.23
  pour Top: 19.2,51.49 19.2,53.82 18.75,54.28 18.75,54.69 18.69,54.74 20.57,54.74 20.65,54.66 20.65,51.51 20.65,51.49
VDD_5V  (via drill 0.25)
  Top 1.016: PI.4 PI.2 | D4.A 56.79,42.01 v56.77,42.04
  Bottom 0.254: PI.2 57.99,3.59 57.99,6.73
  Bottom 1.016: 57.99,6.73 59.56,8.31 59.56,18.75 62.46,21.64 62.46,36.35 v56.77,42.04
VIN
  Top 1.016: R19.2 D6.C
VUSB
  Top 0.254: USB-LTE.VBUS2 48.05,50.23 49.17,51.36 51.79,51.36 52.81,50.34 52.81,49.63 USB-LTE.VBUS1 52.95,47.94 53.95,46.94 D7.A D4.C
  Top 0.61: U6.11 51.99,37.97 53.95,39.93 D4.C
  pour Top: 47.75,48.95 47.75,50.04 49.2,51.49 51.82,51.49 53.21,50.09 53.21,48.51 54.86,46.86 54.86,40.92 53.11,40.92 53.11,46.63 52.73,47.02 52.73,50.06 52.04,50.75 51.84,50.95 49.33,50.95 49.23,50.95 48.39,50.11 48.39,48.95

### Text on the board
tPlace: - | - | + | +
bPlace: 4G LTE Hat For | Raspberry Pi V1.0 | www.makerfabs.com | GND | GPIO26 | GPIO19 | GPIO13 | GPIO06 | GPIO05 | ID_SD | GND | GPIO11 | GPIO09 | GPIO10 | 3.3V | GPIO22 | GPIO27 | GPIO17 | GND | IO04 | GPIO03 | GPIO02 | 3V3 | GPIO21 | GPIO20 | GPIO16 | GND | GPIO12 | GND | ID_SC | GPIO07 | GPIO08 | GPIO25 | GND | GPIO24 | GPIO23 | GND | GPIO18 | GPIO15 | IO14 | GND | 5V | 5V